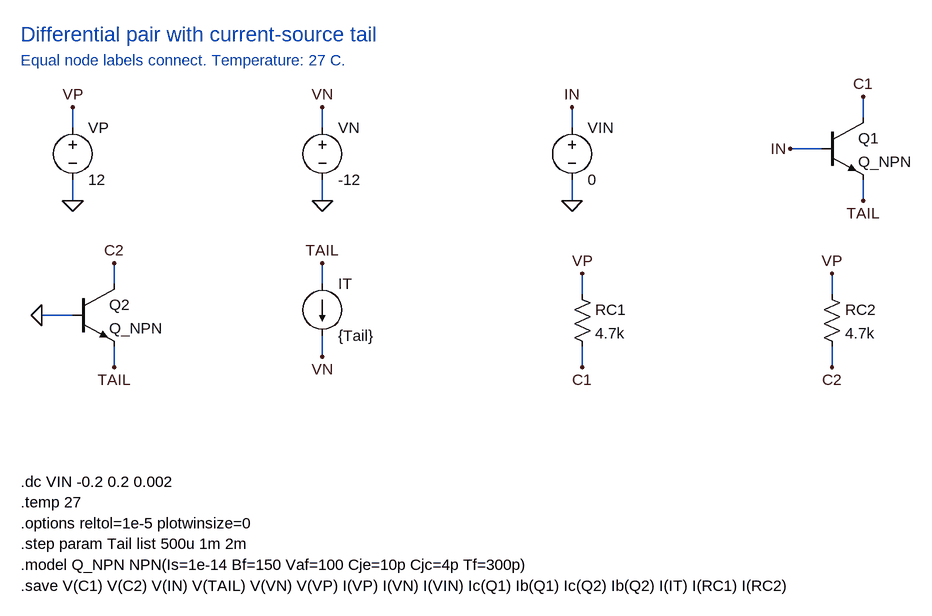
[diagram p0: schematic differential-pair-current-tail.asc]
differential-pair-current-tail.asc, the LTspice schematic file:
Version 4
SHEET 1 1740 1032
WIRE 144 176 144 144
WIRE 144 256 144 288
WIRE 528 176 528 144
WIRE 528 256 528 288
WIRE 912 176 912 144
WIRE 912 256 912 288
WIRE 1360 160 1360 128
WIRE 1296 208 1248 208
WIRE 1360 256 1360 288
WIRE 208 416 208 384
WIRE 144 464 96 464
WIRE 208 512 208 544
WIRE 528 416 528 384
WIRE 528 496 528 528
WIRE 928 432 928 400
WIRE 928 512 928 544
WIRE 1312 432 1312 400
WIRE 1312 512 1312 544
FLAG 144 144 VP
FLAG 144 288 0
FLAG 528 144 VN
FLAG 528 288 0
FLAG 912 144 IN
FLAG 912 288 0
FLAG 1360 128 C1
FLAG 1248 208 IN
FLAG 1360 288 TAIL
FLAG 208 384 C2
FLAG 96 464 0
FLAG 208 544 TAIL
FLAG 528 384 TAIL
FLAG 528 528 VN
FLAG 928 400 VP
FLAG 928 544 C1
FLAG 1312 400 VP
FLAG 1312 544 C2
SYMBOL voltage 144 160 R0
SYMATTR InstName VP
SYMATTR Value 12
SYMBOL voltage 528 160 R0
SYMATTR InstName VN
SYMATTR Value -12
SYMBOL voltage 912 160 R0
SYMATTR InstName VIN
SYMATTR Value 0
SYMBOL npn 1296 160 R0
SYMATTR InstName Q1
SYMATTR Value Q_NPN
SYMBOL npn 144 416 R0
SYMATTR InstName Q2
SYMATTR Value Q_NPN
SYMBOL current 528 416 R0
SYMATTR InstName IT
SYMATTR Value {Tail}
SYMBOL res 912 416 R0
SYMATTR InstName RC1
SYMATTR Value 4.7k
SYMBOL res 1296 416 R0
SYMATTR InstName RC2
SYMATTR Value 4.7k
TEXT 64 32 Left 3 ;Differential pair with current-source tail
TEXT 64 72 Left 2 ;Equal node labels connect. Temperature: 27 C.
TEXT 64 720 Left 2 !.dc VIN -0.2 0.2 0.002
TEXT 64 752 Left 2 !.temp 27
TEXT 64 784 Left 2 !.options reltol=1e-5 plotwinsize=0
TEXT 64 816 Left 2 !.step param Tail list 500u 1m 2m
TEXT 64 848 Left 2 !.model Q_NPN NPN(Is=1e-14 Bf=150 Vaf=100 Cje=10p Cjc=4p Tf=300p)
TEXT 64 880 Left 2 !.save V(C1) V(C2) V(IN) V(TAIL) V(VN) V(VP) I(VP) I(VN) I(VIN) Ic(Q1) Ib(Q1) Ic(Q2) Ib(Q2) I(IT) I(RC1) I(RC2)

The netlist it stands for:
* differential-pair-current-tail.asc
VP VP 0 12
VN VN 0 -12
VIN IN 0 0
Q1 C1 IN TAIL 0 Q_NPN
Q2 C2 0 TAIL 0 Q_NPN
IT TAIL VN {Tail}
RC1 VP C1 4.7k
RC2 VP C2 4.7k
.model NPN NPN
.model PNP PNP
.lib standard.bjt
* Differential pair with current-source tail
* Equal node labels connect. Temperature: 27 C.
.dc VIN -0.2 0.2 0.002
.temp 27
.options reltol=1e-5 plotwinsize=0
.step param Tail list 500u 1m 2m
.model Q_NPN NPN(Is=1e-14 Bf=150 Vaf=100 Cje=10p Cjc=4p Tf=300p)
.save V(C1) V(C2) V(IN) V(TAIL) V(VN) V(VP) I(VP) I(VN) I(VIN) Ic(Q1) Ib(Q1) Ic(Q2) Ib(Q2) I(IT) I(RC1) I(RC2)
.backanno
.end